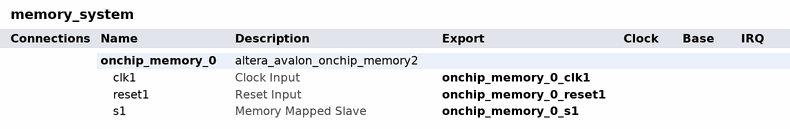
[diagram p0: system contents]
# Platform Designer (Qsys) system memory_system, MAX V 5M1270ZT144C5
# Parameters at their usual value, and those the tool derives, are not listed.
package require -exact qsys 16.1
create_system memory_system
set_project_property DEVICE_FAMILY {MAX V}
set_project_property DEVICE 5M1270ZT144C5

add_instance onchip_memory_0 altera_avalon_onchip_memory2 16.1
set_instance_parameter_value onchip_memory_0 allowInSystemMemoryContentEditor true
set_instance_parameter_value onchip_memory_0 dataWidth 8
set_instance_parameter_value onchip_memory_0 dualPort false
set_instance_parameter_value onchip_memory_0 initMemContent true
set_instance_parameter_value onchip_memory_0 initializationFileName onchip_mem.hex
set_instance_parameter_value onchip_memory_0 instanceID Mem
set_instance_parameter_value onchip_memory_0 memorySize 1024

# exported interfaces
add_interface onchip_memory_0_clk1 clock sink
set_interface_property onchip_memory_0_clk1 EXPORT_OF onchip_memory_0.clk1
add_interface onchip_memory_0_reset1 reset sink
set_interface_property onchip_memory_0_reset1 EXPORT_OF onchip_memory_0.reset1
add_interface onchip_memory_0_s1 avalon slave
set_interface_property onchip_memory_0_s1 EXPORT_OF onchip_memory_0.s1

set_interconnect_requirement {$system} qsys_mm.clockCrossingAdapter HANDSHAKE
set_interconnect_requirement {$system} qsys_mm.enableEccProtection FALSE
set_interconnect_requirement {$system} qsys_mm.insertDefaultSlave FALSE
set_interconnect_requirement {$system} qsys_mm.maxAdditionalLatency 1

save_system memory_system.qsys
